# Altium schematic sheet RFID_MODULE_S01.SchDoc: RF_MODULE
size A4; CheckedBy: R_NAGIIE; DrawnBy: A.RAJABI; SheetNumber: 1; SheetTotal: 1
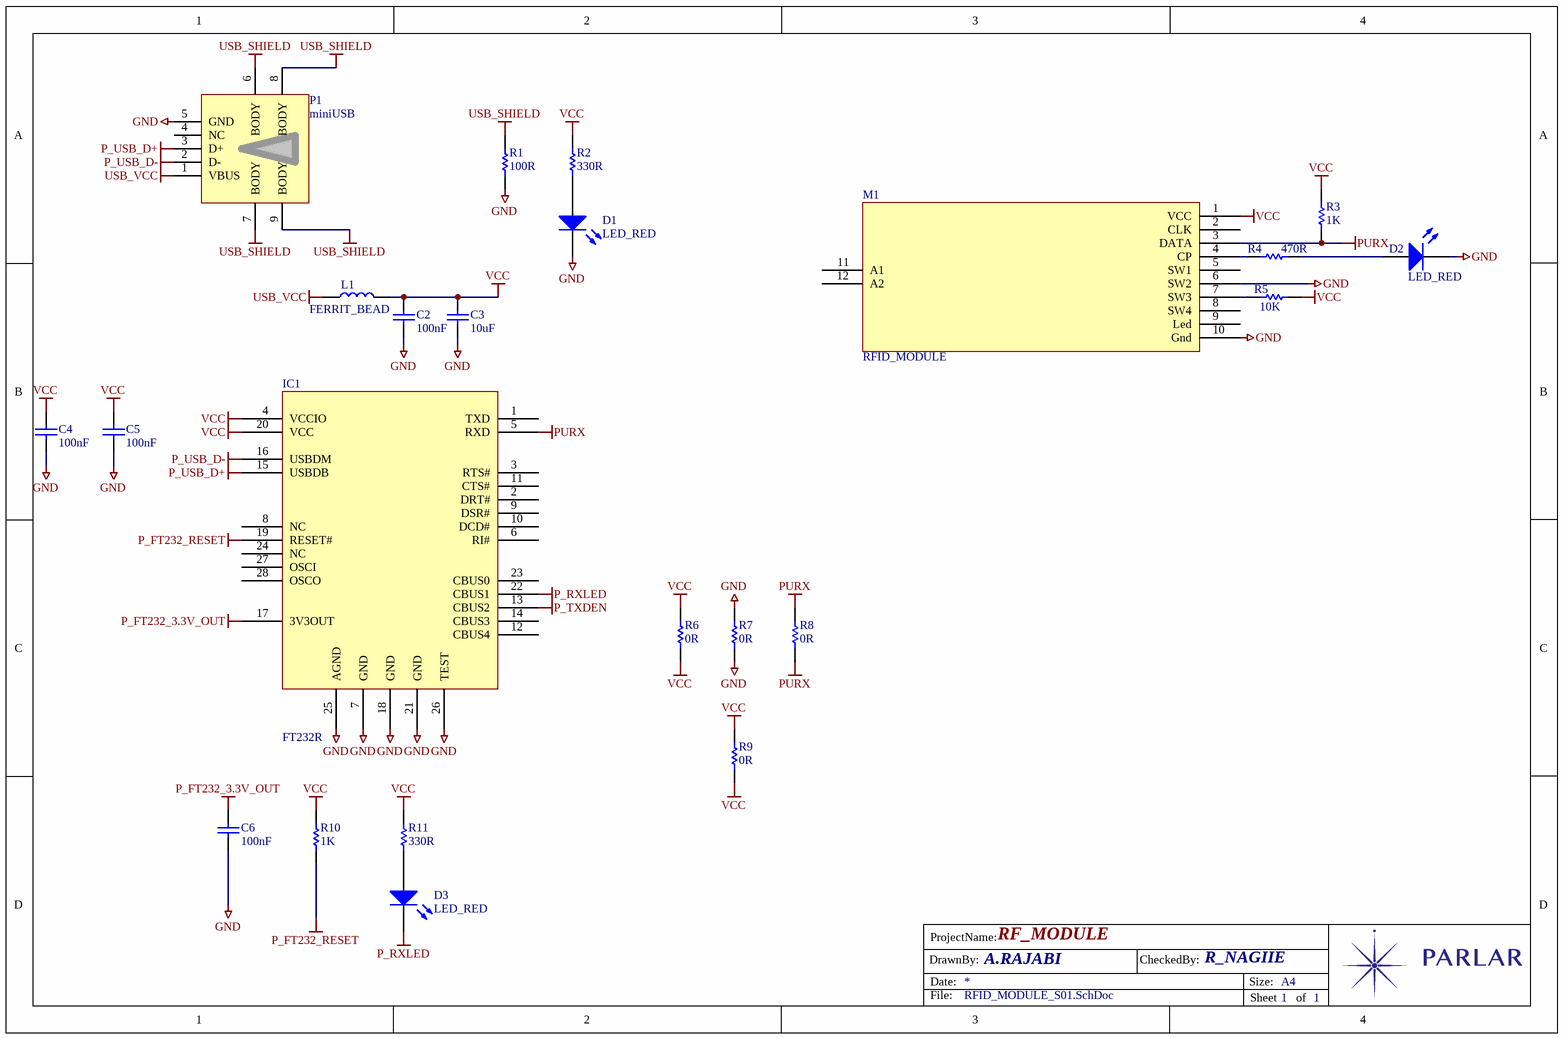
[diagram p0: RFID_MODULE_S01.SchDoc]

## Parts
C2  100nF  [SMD 0805]
C3  10uF  [SMD 0805]
C4  100nF  [SMD 0805]
C5  100nF  [SMD 1206]
C6  100nF  [SMD 0805]
D1  LED_RED  [SMD LED 0603]
D2  LED_RED  [SMD LED 0603]
D3  LED_RED  [SMD LED 0603]
IC1  FT232R  [SMD IC SSOP28]
L1  FERRIT_BEAD  [SMD 1206]
M1  RFID_MODULE  [PCBComponent_1]
P1  miniUSB  [SMD USB B MINI]
R1  100R  [SMD 0805]
R2  330R  [SMD 1206]
R3  1K  [SMD 0805]
R4  470R  [SMD 0805]
R5  10K  [SMD 1206]
R6  0R  [SMD 1206]
R7  0R  [SMD 1206]
R8  0R  [SMD 1206]
R9  0R  [SMD 1206]
R10  1K  [SMD 0805]
R11  330R  [SMD 1206]

## Nets
GND: C2.2 C3.2 C4.2 C5.2 C6.2 D1.2 D2.2 IC1.7(GND) IC1.18(GND) IC1.21(GND) IC1.25(AGND) IC1.26(TEST) M1.6(SW2) M1.10(Gnd) P1.5(GND) R1.1 R7.1 R7.2
P_FT232_3.3V_OUT: C6.1 IC1.17(3V3OUT)
P_FT232_RESET: IC1.19(RESET#) R10.1
P_RXLED: D3.2 IC1.22(CBUS1)
P_TXDEN: IC1.13(CBUS2)
P_USB_D+: IC1.15(USBDB) P1.3(D+)
P_USB_D-: IC1.16(USBDM) P1.2(D-)
PURX: IC1.5(RXD) M1.3(DATA) R3.1 R8.1 R8.2
USB_SHIELD: P1.6(BODY) P1.7(BODY) P1.8(BODY) P1.9(BODY) R1.2
USB_VCC: L1.1 P1.1(VBUS)
VCC: C2.1 C3.1 C4.1 C5.1 IC1.4(VCCIO) IC1.20(VCC) L1.2 M1.1(VCC) R2.2 R3.2 R5.2 R6.1 R6.2 R9.1 R9.2 R10.2 R11.2
NetD1_1: D1.1 R2.1
NetD2_1: D2.1 R4.2
NetD3_1: D3.1 R11.1
NetM1_4: M1.4(CP) R4.1
NetM1_7: M1.7(SW3) R5.1

Not connected (* = marked no-connect by the designer): IC1 1(TXD) 2(DRT#) 3(RTS#) 6(RI#) 8(NC) 9(DSR#) 10(DCD#) 11(CTS#) 12(CBUS4) 14(CBUS3) 23(CBUS0) 24(NC) 27(OSCI) 28(OSCO); M1 2(CLK) 5(SW1) 8(SW4) 9(Led) 11(A1) 12(A2); P1 4(NC)

## Notes on the sheet
- DrawnBy:
- ProjectName:
- Date:
- CheckedBy:
- Size:
- A4
- File:
- Sheet
- of

## Library data of the parts
C2-C6 = CAP: Capacitor; Published: 8-Jun-2000; LatestRevisionDate: 17-Jul-2002; LatestRevisionNote: Re-released for DXP Platform.; PackageReference: RAD-0.3; Publisher: Altium Limited; PackageDescription: Radial Cap, Thru-Hole; 2 Leads; 0.3 in Pin Spacing
D1-D3 = LED: Typical INFRARED GaAs LED; Published: 8-Jun-2000; LatestRevisionDate: 08-Jul-2005; LatestRevisionNote: Mech Layer 1 removed.; PackageReference: LED-0; Publisher: Altium Limited; PackageDescription: LED; 2 Leads
L1 = INDUCTOR
P1 = CON miniUSB Female SMD
R1-R11 = RES: Resistor